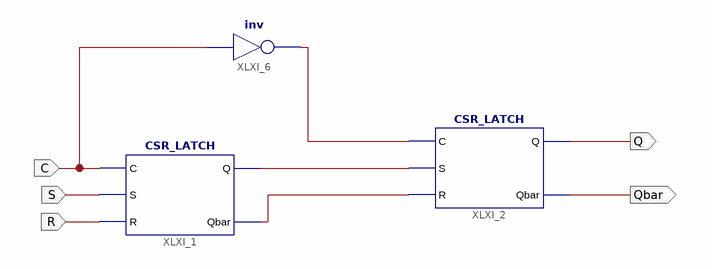
[diagram p0: schematic sheet 1]
// Xilinx ISE schematic MS_FLIPFLOP.sch (kintex7) as structural Verilog: 3 symbols, 5 ports
module MS_FLIPFLOP (
  input  S,
  input  R,
  input  C,
  output Q,
  output Qbar
);

  wire XLXN_16, XLXN_20, XLXN_21;

  CSR_LATCH XLXI_1 (.C(C), .S(S), .R(R), .Q(XLXN_21), .Qbar(XLXN_16));
  CSR_LATCH XLXI_2 (.C(XLXN_20), .S(XLXN_21), .R(XLXN_16), .Q(Q), .Qbar(Qbar));
  not XLXI_6 (XLXN_20, C);
endmodule
